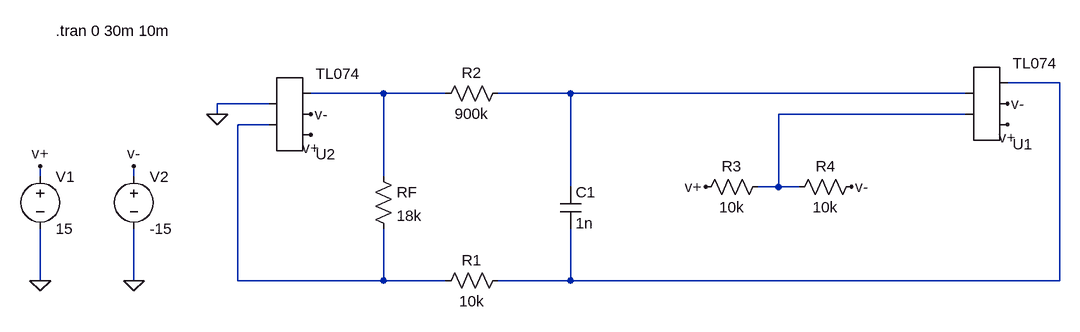
[diagram p0: schematic PrimeraEtapa.asc]
PrimeraEtapa.asc, the LTspice schematic file:
Version 4
SHEET 1 1060 680
WIRE 1056 192 976 192
WIRE 16 208 -96 208
WIRE 112 208 16 208
WIRE 304 208 192 208
WIRE 912 208 304 208
WIRE -160 224 -240 224
WIRE -240 240 -240 224
WIRE 912 240 624 240
WIRE -160 256 -208 256
WIRE -512 336 -512 320
WIRE -368 336 -368 320
WIRE 16 336 16 208
WIRE 304 352 304 208
WIRE 624 352 624 240
WIRE 624 352 592 352
WIRE 656 352 624 352
WIRE -512 496 -512 416
WIRE -368 496 -368 416
WIRE -208 496 -208 256
WIRE 16 496 16 416
WIRE 16 496 -208 496
WIRE 112 496 16 496
WIRE 304 496 304 416
WIRE 304 496 192 496
WIRE 1056 496 1056 192
WIRE 1056 496 304 496
FLAG 976 256 v+
FLAG 976 224 v-
FLAG -240 240 0
FLAG 512 352 v+
FLAG 736 352 v-
FLAG -96 272 v+
FLAG -96 240 v-
FLAG -512 496 0
FLAG -368 496 0
FLAG -512 320 v+
FLAG -368 320 v-
SYMBOL res 0 320 R0
SYMATTR InstName RF
SYMATTR Value 18k
SYMBOL res 208 192 R90
WINDOW 0 0 56 VBottom 2
WINDOW 3 32 56 VTop 2
SYMATTR InstName R2
SYMATTR Value 900k
SYMBOL res 208 480 R90
WINDOW 0 0 56 VBottom 2
WINDOW 3 32 56 VTop 2
SYMATTR InstName R1
SYMATTR Value 10k
SYMBOL cap 288 352 R0
SYMATTR InstName C1
SYMATTR Value 1n
SYMBOL res 608 336 R90
WINDOW 0 0 56 VBottom 2
WINDOW 3 32 56 VTop 2
SYMATTR InstName R3
SYMATTR Value 10k
SYMBOL res 752 336 R90
WINDOW 0 0 56 VBottom 2
WINDOW 3 32 56 VTop 2
SYMATTR InstName R4
SYMATTR Value 10k
SYMBOL AutoGenerated/TL074 944 224 M180
SYMATTR InstName U1
SYMBOL AutoGenerated/TL074 -128 240 M180
SYMATTR InstName U2
SYMBOL voltage -512 320 R0
WINDOW 123 0 0 Left 2
WINDOW 39 0 0 Left 2
SYMATTR InstName V1
SYMATTR Value 15
SYMBOL voltage -368 320 R0
WINDOW 123 0 0 Left 2
WINDOW 39 0 0 Left 2
SYMATTR InstName V2
SYMATTR Value -15
TEXT -488 112 Left 2 !.tran 0 30m 10m

The netlist it stands for:
* PrimeraEtapa.asc
RF N002 N005 18k
R2 N003 N002 900k
R1 N001 N005 10k
C1 N003 N001 1n
R3 N004 v+ 10k
R4 v- N004 10k
* U1: TL074 (symbol AutoGenerated/TL074 not available, pins judged from their places): pin1=N004 pin2=N003 pin3=v+ pin4=v- pin5=N001
* U2: TL074 (symbol AutoGenerated/TL074 not available, pins judged from their places): pin1=N005 pin2=0 pin3=v+ pin4=v- pin5=N002
V1 v+ 0 15
V2 v- 0 -15
.tran 0 30m 10m
.backanno
.end